# EasyEDA schematic 1-Schematic_EE463_Project.json
TITLE: DC Motor Drive; REV: 1.0; Date: 2022-01-01; Sheet: 1/1; Drawn By: zehragunes.13; Company: Group2
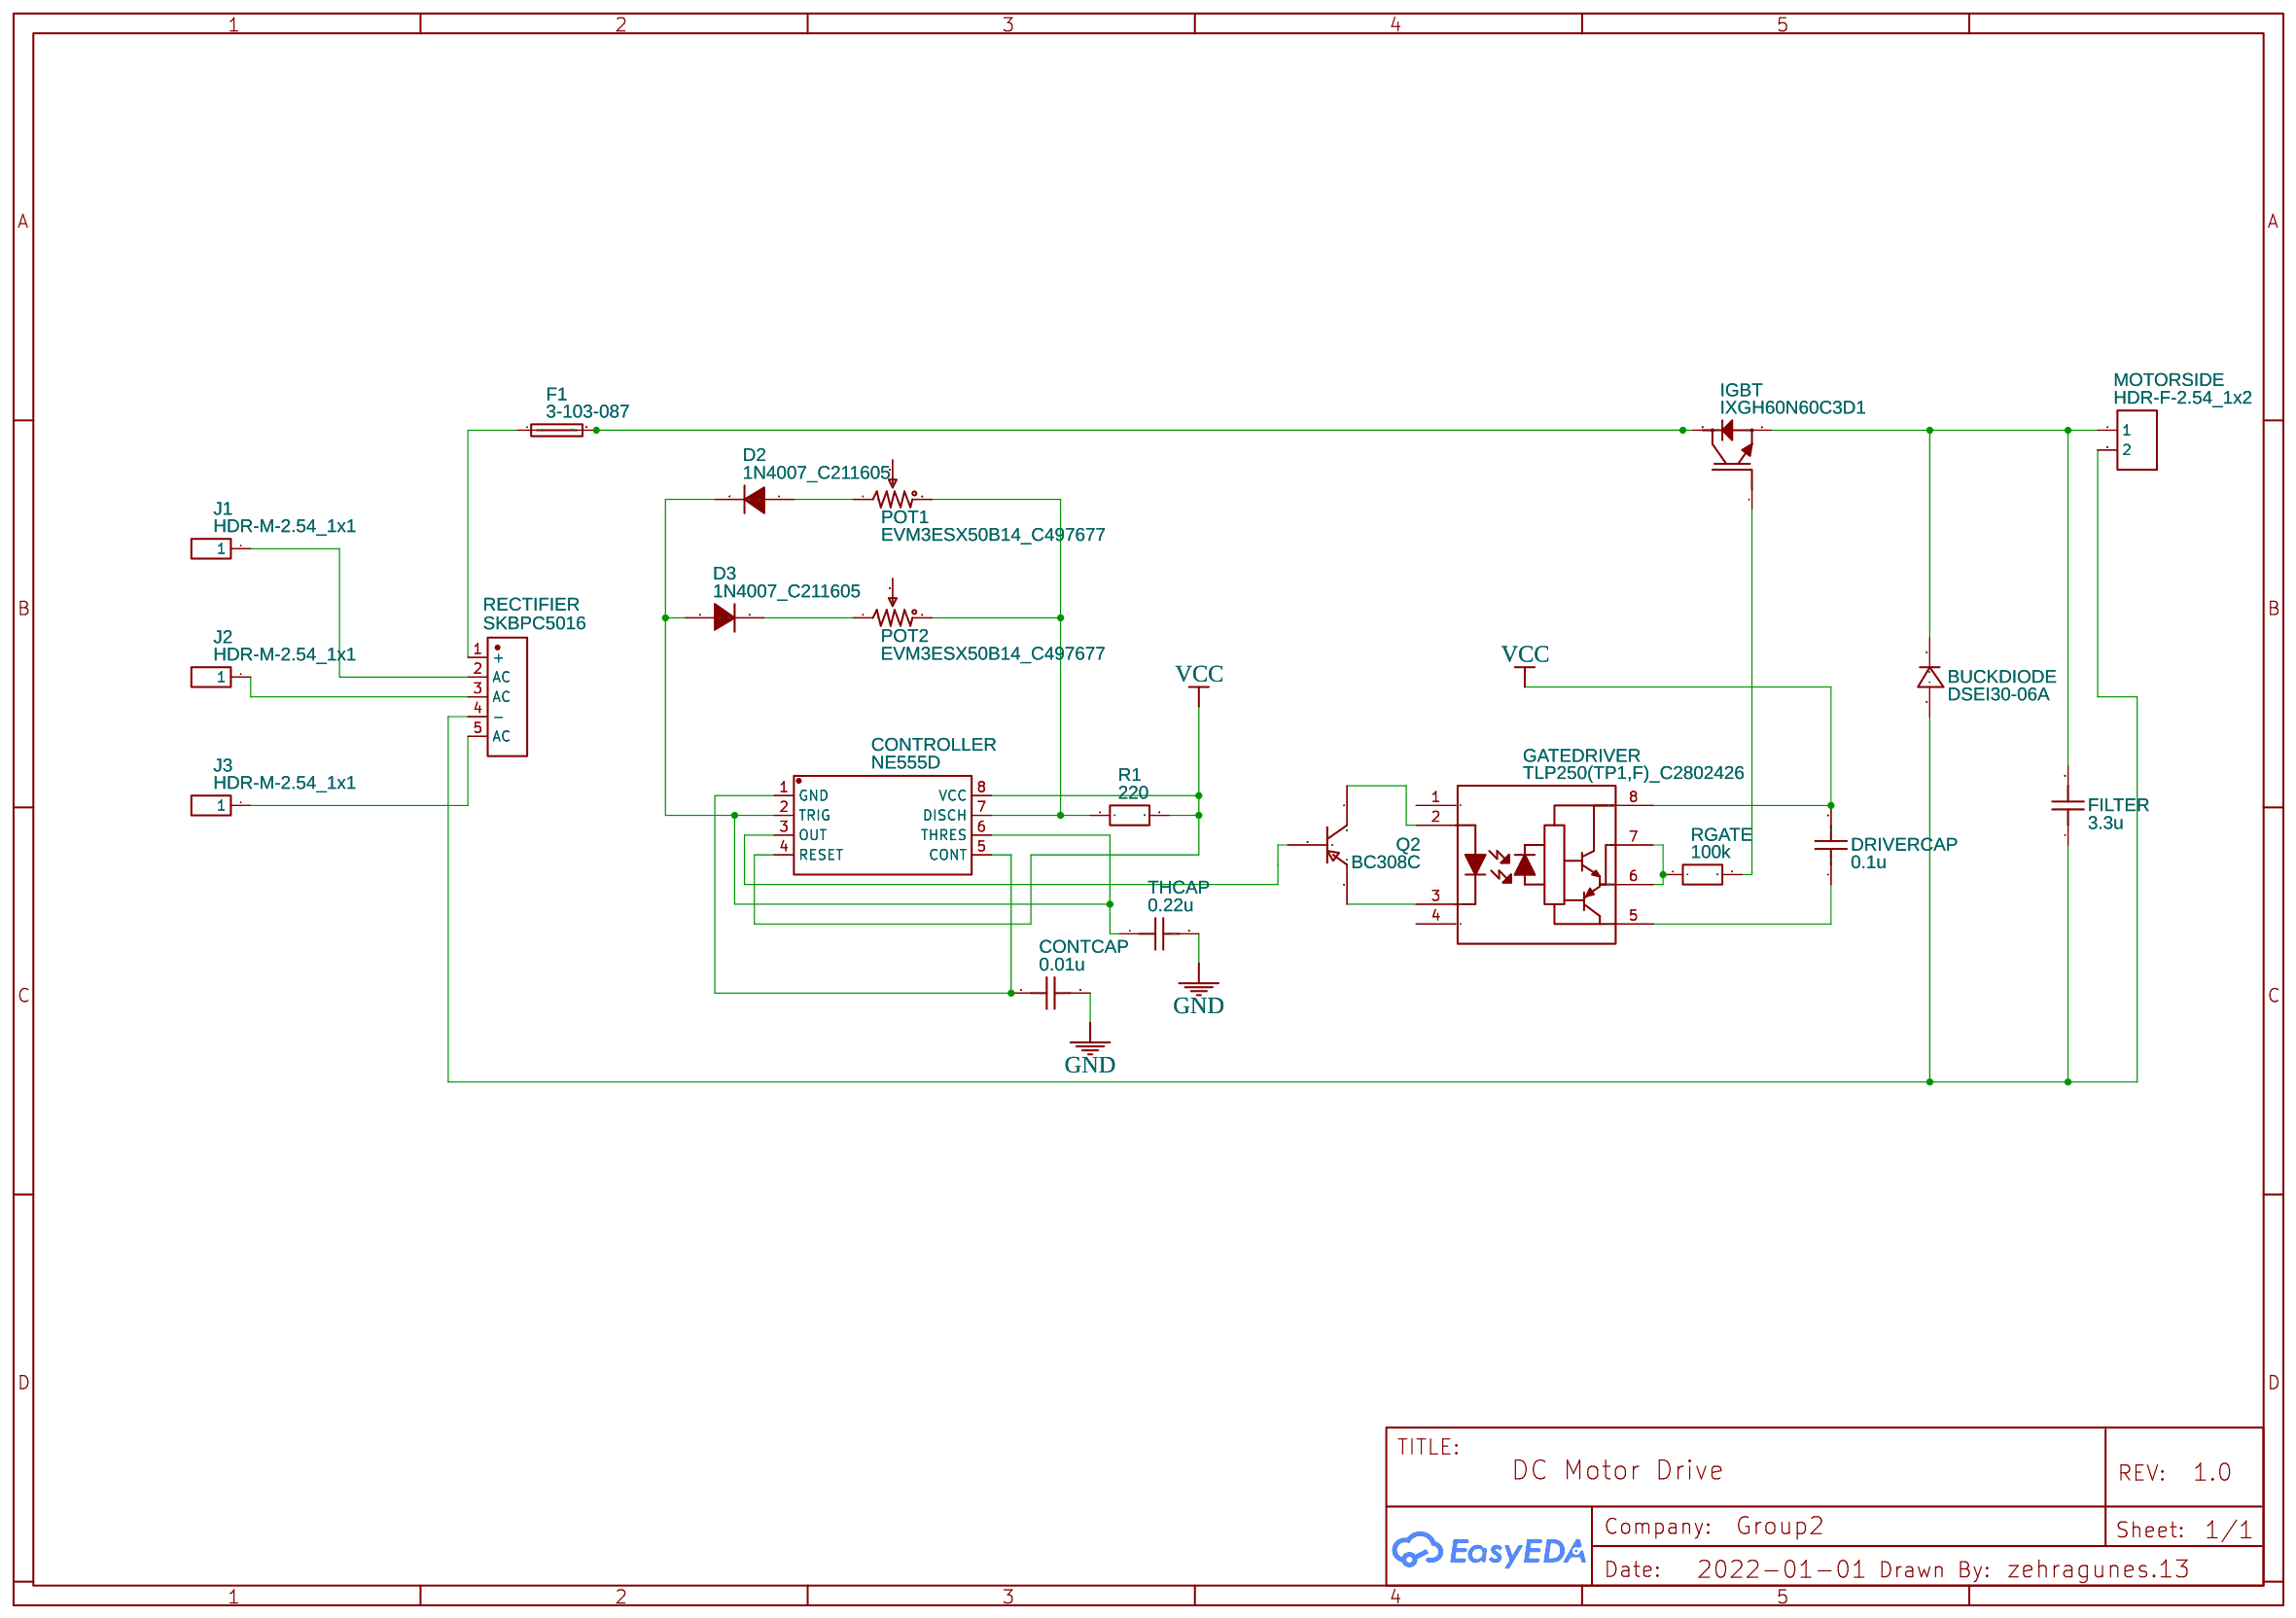
[diagram p0: schematic sheet]

## Parts
BUCKDIODE  DSEI30-06A  [TO-247-2_L15.8-W5.0-P10.92-L]
CONTCAP  0.01u  [C0603]
CONTROLLER  NE555D  [SOIC-8_L5.0-W4.0-P1.27-LS6.0-BL]
D2  1N4007_C211605  [DO-41_BD2.4-L4.7-P8.70-D0.9-FD]
D3  1N4007_C211605  [DO-41_BD2.4-L4.7-P8.70-D0.9-FD]
DRIVERCAP  0.1u  [C0603]
F1  3-103-087  [FUSE-SMD_L3.2-W1.6-1]
FILTER  3.3u  [C0603]
GATEDRIVER  TLP250(TP1,F)_C2802426  [OPTO-SMD-8P_L9.6-W6.5-P2.54-LS10.0-BL]
IGBT  IXGH60N60C3D1  [TO-247-3_L15.9-W5.1-P5.44-L]
J1  HDR-M-2.54_1x1  [HDR-M-2.54_1X1]
J2  HDR-M-2.54_1x1  [HDR-M-2.54_1X1]
J3  HDR-M-2.54_1x1  [HDR-M-2.54_1X1]
MOTORSIDE  HDR-F-2.54_1x2  [HDR-F-2.54_1X2]
POT1  EVM3ESX50B14_C497677  [RES-ADJ_3P_L3.1-W3.1-EVM3ESX50B14]
POT2  EVM3ESX50B14_C497677  [RES-ADJ_3P_L3.1-W3.1-EVM3ESX50B14]
Q2  BC308C  [TO92-INLINE]
R1  220  [R0201]
RECTIFIER  SKBPC5016  [DIO-BG-TH_SKBPC5016]
RGATE  100k  [R0201]
THCAP  0.22u  [C0603]

## Library data of the parts
BUCKDIODE = DSEI30-06A: Supplier: LCSC; Supplier Part: C424091; Manufacturer: IXYS; Contributor: LCSC; JLCPCB Part Class: Extended Part
CONTCAP DRIVERCAP FILTER THCAP = C_0603_US: Contributor: LCEDA_Lib
CONTROLLER = NE555D: Supplier: LCSC; Supplier Part: C234230; Manufacturer: Texas Instruments; Contributor: LCSC; JLCPCB Part Class: Extended Part
D2 D3 = 1N4007_C211605: Supplier: LCSC; Supplier Part: C211605; Manufacturer: Yangzhou Yangjie Elec Tech; Manufacturer Part: 1N4007; Contributor: LCSC; JLCPCB Part Class: Extended Part
F1 = 3-103-087: Supplier: LCSC; Supplier Part: C1972628; Manufacturer: SCHURTER; Contributor: LCSC
GATEDRIVER = TLP250(TP1,F)_C2802426: Supplier: LCSC; Supplier Part: C2802426; Manufacturer: TOSHIBA(东芝); Manufacturer Part: TLP250(TP1,F); Contributor: LCSC; JLCPCB Part Class: Extended Part
IGBT = IXGH60N60C3D1: Supplier: LCSC; Supplier Part: C497181; Manufacturer: IXYS; Contributor: LCSC; JLCPCB Part Class: Extended Part
J1-J3 = HDR-M-2.54_1x1: Supplier Part: C81276; Supplier: LCSC; Contributor: LCEDA_Lib
MOTORSIDE = HDR-F-2.54_1x2: Supplier Part: C49661; Supplier: LCSC; Contributor: LCEDA_Lib
POT1 POT2 = EVM3ESX50B14_C497677: Supplier: LCSC; Supplier Part: C497677; Manufacturer: PANASONIC(松下); Manufacturer Part: EVM3ESX50B14; JLCPCB Part Class: Extended Part; Contributor: LCSC
Q2 = BC308C: Amplifier Transistor PNP Silicon
R1 RGATE = R_0201_EU: Contributor: LCEDA_Lib
RECTIFIER = SKBPC5016: Supplier: LCSC; Supplier Part: C781432; Manufacturer: YANGJIE(扬杰); JLCPCB Part Class: Extended Part; Contributor: LCSC

## Nets
GND: CONTCAP.2 THCAP.2
VCC: CONTROLLER.4(RESET) CONTROLLER.8(VCC) DRIVERCAP.2 GATEDRIVER.8(VCC) R1.2
Net-(BUCKDIODE-1): BUCKDIODE.1(C) FILTER.2 IGBT.3(E) MOTORSIDE.1
Net-(BUCKDIODE-3): BUCKDIODE.3(A) FILTER.1 MOTORSIDE.2 RECTIFIER.4(-)
Net-(CONTCAP-1): CONTCAP.1 CONTROLLER.1(GND) CONTROLLER.5(CONT)
Net-(CONTROLLER-2): CONTROLLER.2(TRIG) CONTROLLER.6(THRES) D2.2(C) D3.1(A) THCAP.1
Net-(CONTROLLER-3): CONTROLLER.3(OUT) Q2.2(B)
Net-(CONTROLLER-7): CONTROLLER.7(DISCH) POT1.3 POT2.3 R1.1
Net-(D2-1): D2.1(A) POT1.1
Net-(D3-2): D3.2(C) POT2.1
Net-(DRIVERCAP-1): DRIVERCAP.1 GATEDRIVER.5(GND)
Net-(F1-1): F1.1 RECTIFIER.1(+)
Net-(F1-2): F1.2 IGBT.2(C)
Net-(GATEDRIVER-2): GATEDRIVER.2 Q2.1(C)
Net-(GATEDRIVER-3): GATEDRIVER.3 Q2.3(E)
Net-(GATEDRIVER-6): GATEDRIVER.6 GATEDRIVER.7 RGATE.1
Net-(IGBT-1): IGBT.1(G) RGATE.2
Net-(J1-1): J1.1 RECTIFIER.2(AC)
Net-(J2-1): J2.1 RECTIFIER.3(AC)
Net-(J3-1): J3.1 RECTIFIER.5(AC)

Not connected (* = marked no-connect by the designer): GATEDRIVER 1 4; POT1 2; POT2 2
